# Altium project Capstone_SDR_PLUTOV2.PrjPcb (part 2 of 2)

## Sheet POWERMANAGE2.SchDoc
size A3; SheetNumber: 11; SheetTotal: 13; SPICEModelCacheVRZJBZTH: <root> / <DocumentId>VRZJBZTH</DocumentId> / <CacheFrame Number="0"> / <Model Name="emk105bj105_v-f" Kind="CKT"> / <Text>* EMK105BJ105_V-F     SPICE MODEL  ( General Type ) / *-------------------------------------------------------------------------------------------------------- / * Model Generated by TAIYO YUDEN Corporation (http://www.ty-top.com) / * Version 1.0 / * TAIYO YUDEN Control No. 170508_130520 / * Copyright(c) 2012 TAIYO YUDEN CO.,LTD. All Rights Reserved. / *-------------------------------------------------------------------------------------------------------- / * / * Products Name : Multilayer Ceramic Capacitors / * / * Characteristics : / *     Capacitance : 1 uF , Rated Voltage : 16V , TCC : X5R / *     Case Size : 1.0 x 0.5 / 0.039 x 0.02 [mm/inch] , Thickness : 0.5 / 0.02 [mm/inch] / *     (Conditions: Temperature = 25 degC , DC Bias Current/Voltage = 0A / 0V) / * / * Frequency Range : 40Hz - 3GHz / * / * External Node Assignments : / * / *  1  o---| |---o  2 / * / *-------------------------------------------------------------------------------------------------------- / .SubCkt EMK105BJ105_V-F 1 2 / **************************** / C0 1 110 0.68309u / Cm 1 101 0.26053u / C1 101 102 0.94076u / Rc1 101 102 1.9029k / C2 102 103 0.66707u / Rc2 102 103 120.36 / C3 103 110 0.57203u / Rc3 103 110 2.1097 / C2m 1 301 0.1871u / C21 301 302 3.2494u / Rc21 301 302 1.1117k / C22 302 303 2.1014u / Rc22 302 303 1.484k / C23 303 304 2.1172u / Rc23 303 304 1.3876k / C24 304 305 0.75729u / Rc24 304 305 332.59 / C25 305 306 0.94401u / Rc25 305 306 249.09 / C26 306 307 0.34674u / Rc26 306 307 28.352 / C27 307 308 0.37158u / Rc27 307 308 19.989 / C28 308 309 0.17933u / Rc28 308 309 31.748 / C29 309 110 0.016445u / Rc29 309 110 1.0592 / Rp0 1 110 100Meg / L0 110 120 0.2216n / Lm 120 130 0.1509n / L1 120 121 0.12659n / RL1 121 130 0.85161 / L2 120 122 0.15996n / RL2 122 130 0.42469 / L3 120 123 7.9543n / RL3 123 130 0.54643m / CR 120 124 0.24334u / LR 124 125 0.090738n / RR 125 130 68.076m / CL 130 140 2.7354p / LL 130 140 0.10762n / RL 130 140 50.614 / Rs 140 2 7.5416m / **************************** / .ends EMK105BJ105_V-F</Text> / </Model> / </CacheFrame> / </root>
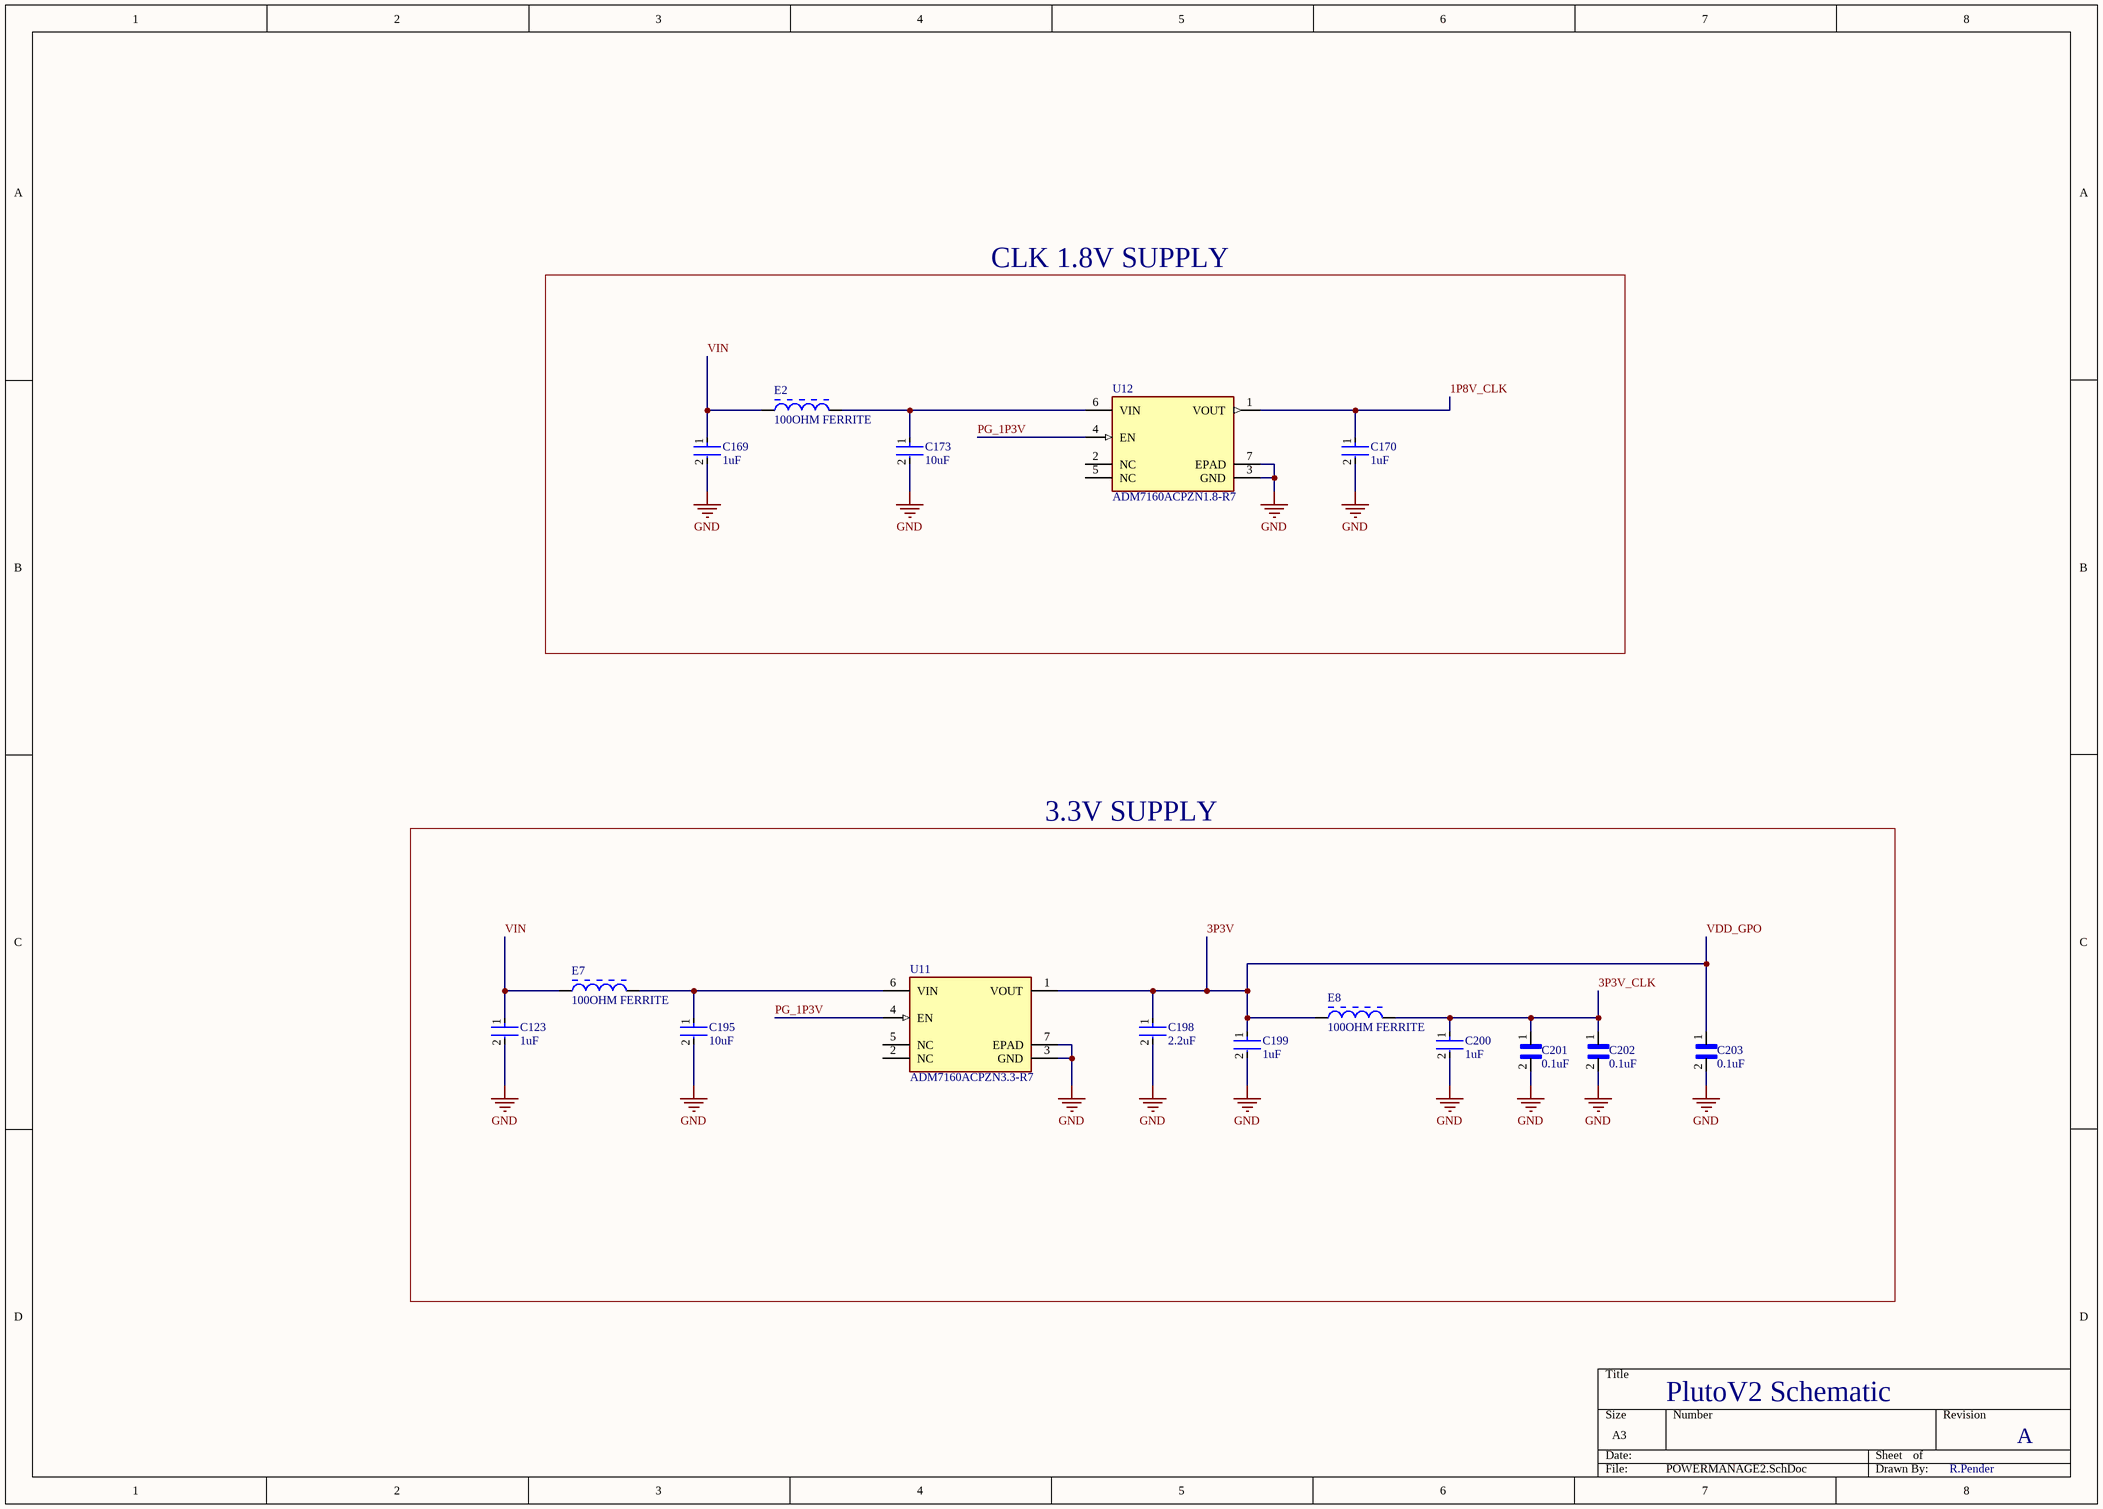
[diagram p4: POWERMANAGE2.SchDoc]

### Parts
C123  1uF  [FP-0402-L_1_0_0_05-W_0_5-IPC_A]
C169  1uF  [FP-0402-L_1_0_0_05-W_0_5-IPC_A]
C170  1uF  [FP-0402-L_1_0_0_05-W_0_5-IPC_B]
C173  10uF  [FP-GRM188-0_15-MFG]
C195  10uF  [FP-GRM188-0_15-MFG]
C198  2.2uF  [FP-GRM188-0_2-MFG]
C199  1uF  [FP-0402-L_1_0_0_05-W_0_5-IPC_A]
C200  1uF  [FP-0402-L_1_0_0_05-W_0_5-IPC_A]
C201  0.1uF  [CAPC0603X33N]
C202  0.1uF  [CAPC0603X33N]
C203  0.1uF  [CAPC0603X33N]
E2  100OHM FERRITE  [TDK-MPZ2012S101A-2_V]
E7  100OHM FERRITE  [TDK-MPZ2012S101A-2_V]
E8  100OHM FERRITE  [TDK-MPZ2012S101A-2_V]
U11  ADM7160ACPZN3.3-R7  [FP-CP-6-3-IPC_A]
U12  ADM7160ACPZN1.8-R7  [FP-CP-6-3-IPC_C]

### Blocks framed on the sheet
CLK 1.8V SUPPLY: C169 C170 C173 E2 U12
3.3V SUPPLY: C123 C195 C198-C203 E7 E8 U11

### Nets
GND: C123.2 C169.2 C170.2 C173.2 C195.2 C198.2 C199.2 C200.2 C201.2 C202.2 C203.2 U11.3(GND) U11.7(EPAD) U12.3(GND) U12.7(EPAD)
1P8V_CLK: C170.1 U12.1(VOUT)
3P3V: C198.1 C199.1 C203.1 E8.1 U11.1(VOUT)  [also labelled VDD_GPO]
3P3V_CLK: C200.1 C201.1 C202.1 E8.2
PG_1P3V: U11.4(EN) U12.4(EN)
VIN: C123.1 C169.1 E2.1 E7.1
NetC173_1: C173.1 E2.2 U12.6(VIN)
NetC195_1: C195.1 E7.2 U11.6(VIN)

Not connected (* = marked no-connect by the designer): U11 2(NC) 5(NC); U12 2(NC) 5(NC)

### Notes on the sheet
- PlutoV2 Schematic
- A
- R.Pender

### Library data of the parts
C123 C169 C170 C199 C200 = CMP-14477-000104-2: None; Tolerance: 10%; Voltage Rating: 16V; Dielectric: X5R; Packaging: Tape and Reel; Depth: 0.5mm; Mount: Surface Mount; Thickness: 0.022inch; Package Quantity: 1; Min Operating Temperature: -55°C; Series: M; Voltage Rating (DC): 16V; Termination: SMD/SMT; Case/Package: 0402; Number of Pins: 2; Case Code (Imperial): 0402; Capacitance: 1uF; Length: 1mm; Halogen Free: Halogen Free; Case Code (Metric): 1005; Width: 0.02inch; RoHS Compliant: Yes; Radiation Hardening: No; Max Operating Temperature: 85°C; Height: 0.5mm; Construction: Flat
C173 C195 = CMP-06035-003612-1: Chip Multilayer Ceramic Capacitors for General Purpose, 0603, 10uF, X5R, 15%, 20%, 10V; Tolerance: 20%; Dielectric: X5R; Package Quantity: 4000; Width: 0.8mm; Case/Package: 0603; Thickness: 0.035inch; Capacitance: 10uF; Voltage Rating: 10V; Voltage Rating (DC): 10V; Termination: SMD/SMT; Length: 1.6mm; Lead Free: Lead Free; Mount: Surface Mount; Height: 0.8mm; Depth: 0.8mm; Packaging: Tape and Reel; Weight: 0.000222oz; Min Operating Temperature: -55°C; Case Code (Metric): 1608; Max Operating Temperature: 85°C; Case Code (Imperial): 0603; Material: Ceramic
C198 = CMP-06035-023692-1: Chip Multilayer Ceramic Capacitors for General Purpose, 0603, 2.2uF, X5R, 15%, 10%, 50V; Mount: Surface Mount; Case/Package: 0603; Voltage Rating (DC): 50V; Weight: 0.000222oz; Capacitance: 2.2uF; Max Operating Temperature: 85°C; Length: 0.063inch; Thickness: 0.039inch; Dielectric: X5R; Min Operating Temperature: -55°C; Termination: SMD/SMT; Resistor Type: Ceramic; Width: 0.8mm; Voltage Rating: 50V; Height: 0.8mm; Tolerance: 10%; Case Code (Metric): 1608; Package Quantity: 10000; Packaging: Tape and Reel; Case Code (Imperial): 0603
C201-C203 = GRM033R61C104ME84D: CAP 0.1UF 16VDC X5R 20% SMD 0201 PAPER TAPE; Package: None; Price: None; Value: *; MP: GRM033R61C104ME84D; Availability: Unavailable
E2 E7 E8 = CMP-2000-05399-1: Chip Bead for Power Line, 100 Ohm, +/- 25%, 4 A, -55 to 125 degC, 0805 (2012 Metric), RoHS, Tape and Reel; Manufacturer: TDK; Maximum DC Resistance: 20mOhms; Test Frequency: 100MHz; Impedance: 100Ohms; Case Width: 1.25mm; Case Length: 2mm; Maximum DC Current: 4A; Case Height: 0.85mm; Package Reference: MPZ2012S101A-2; RoHS: Details; Tolerance: 25%; Operating Temperature Range: -55Cto+125C; Datasheet Version: Jul-13; Dimensions: 1.25mmWx2mmLx0.85mmH; Product: FerriteChipBeads; Termination Style: SMD/SMT; Datasheet URL: http://www.farnell.com/datasheets/1750041.pdf; Factory Pack Quantity: 4000; Brand: TDK; Packaging: Reel; Package Description: 2-Pin Surface Mount Device, Body 2 x 1.25 mm; Product Category: EMIFilterBeads,Chips&Arrays; Manufacturer URL: http://www.tdk.com/; Package / Case: 0805(2012metric)
U11 = CMP-09138-000129-1: IC REG LINEAR 3.3V 200MA 6LFCSP; Output Type: Fixed; Max Supply Current: 265uA; Max Input Voltage: 5.5V; Number of Regulators: 1; Power Supply Rejection Ratio (PSRR): 49dB; Operating Supply Current: 265mA; Polarity: Positive; Min Input Voltage: 2.2V; Dropout Voltage: 150mV; Accuracy: 1%; Min Current Limit: 220mA; Max Output Current: 200mA; RoHS Compliant: Yes; Case/Package: TSOT; Max Operating Temperature: 125°C; Contact Plating: Gold; Number of Pins: 6; Mount: Surface Mount; Packaging: Tape and Reel; Number of Outputs: 1; Lead Free: Contains Lead; Package Quantity: 3000; Min Operating Temperature: -40°C; Output Voltage: 3.3V; Output Current: 200mA; Quiescent Current: 265uA
U12 = CMP-09138-000112-1: IC REG LINEAR 1.8V 200MA 6LFCSP; Operating Supply Current: 265mA; Power Supply Rejection Ratio (PSRR): 49dB; Polarity: Positive; Max Supply Current: 265uA; Dropout Voltage: 230mV; Number of Outputs: 1; Min Current Limit: 220mA; Output Type: Fixed; Accuracy: 1%; Min Input Voltage: 2.2V; Max Input Voltage: 5.5V; Packaging: Tape and Reel; Case/Package: TSOT; Contact Plating: Gold; Mount: Surface Mount; Max Output Current: 200mA; Min Operating Temperature: -40°C; Output Voltage: 1.8V; Output Current: 200mA; Number of Pins: 6; Package Quantity: 3000; Lead Free: Contains Lead; Quiescent Current: 265uA; Max Operating Temperature: 125°C; Number of Regulators: 1; RoHS Compliant: Yes

## Sheet TESTPOINTS.SchDoc
size A3; SheetNumber: 12; SheetTotal: 14
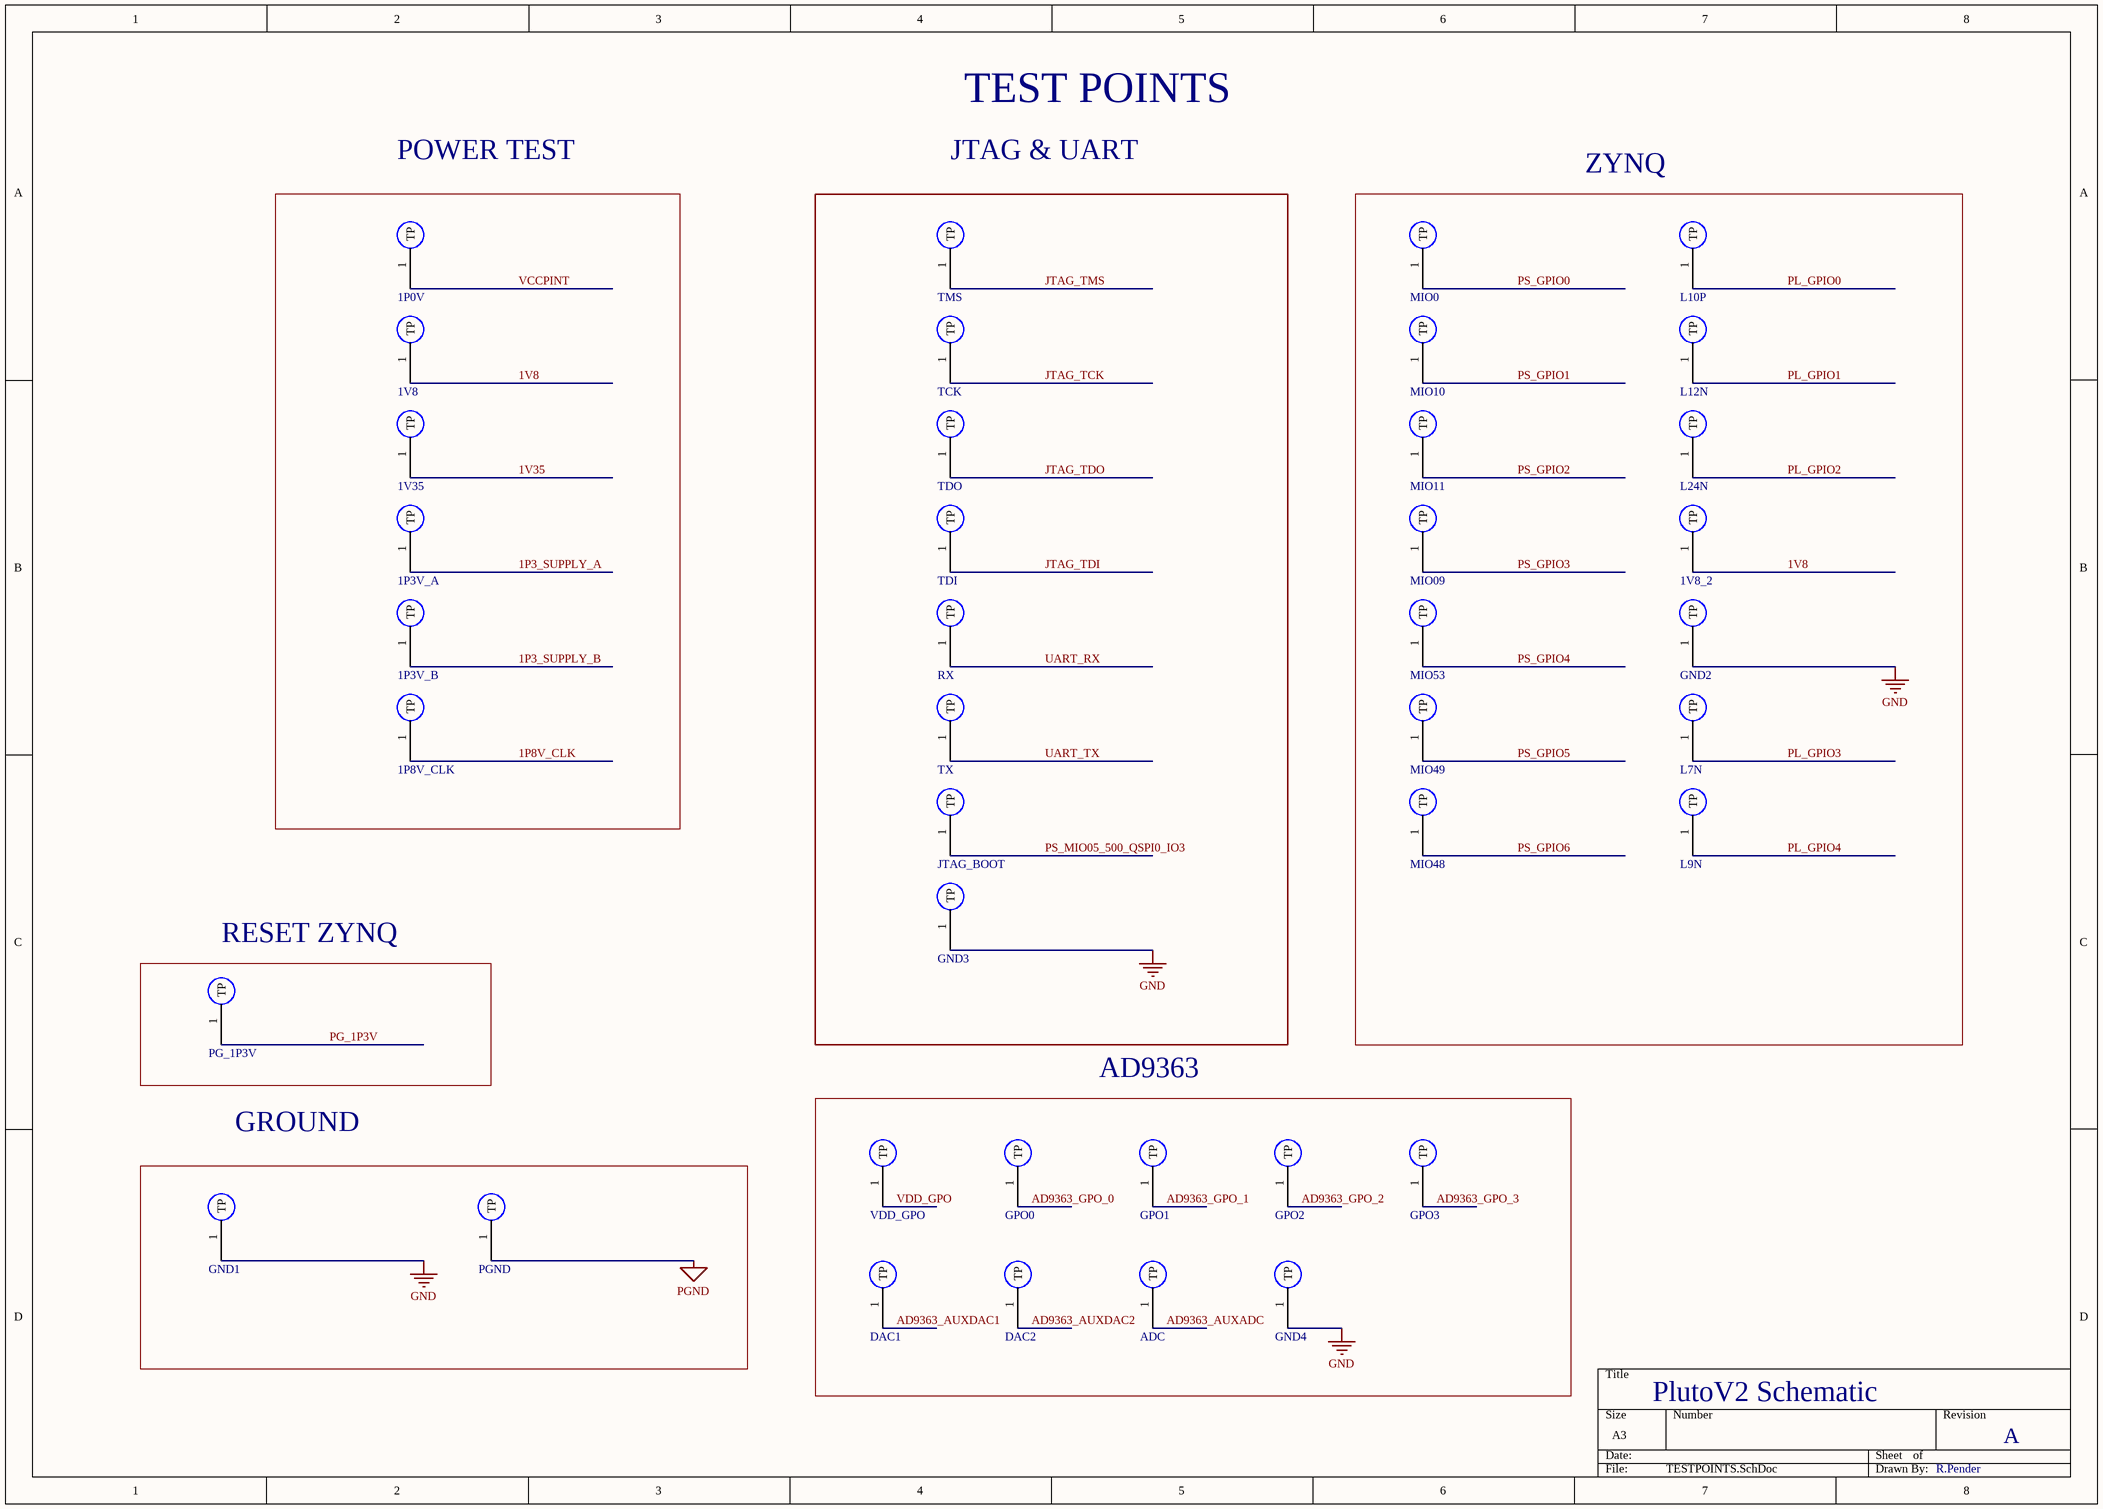
[diagram p5: TESTPOINTS.SchDoc]

### Parts
1P0V  TEST POINT  [TESTPOINT1]  (value not drawn)  (no BOM)
1P3V_A  TEST POINT  [TESTPOINT1]  (value not drawn)  (no BOM)
1P3V_B  TEST POINT  [TESTPOINT1]  (value not drawn)  (no BOM)
1P8V_CLK  TEST POINT  [TESTPOINT1]  (value not drawn)  (no BOM)
1V8  TEST POINT  [TESTPOINT1]  (value not drawn)  (no BOM)
1V8_2  TEST POINT  [TESTPOINT1]  (value not drawn)  (no BOM)
1V35  TEST POINT  [TESTPOINT1]  (value not drawn)  (no BOM)
ADC  TEST POINT  [TESTPOINT1]  (value not drawn)  (no BOM)
DAC1  TEST POINT  [TESTPOINT1]  (value not drawn)  (no BOM)
DAC2  TEST POINT  [TESTPOINT1]  (value not drawn)  (no BOM)
GND1  TEST POINT  [TESTPOINT1]  (value not drawn)  (no BOM)
GND2  TEST POINT  [TESTPOINT1]  (value not drawn)  (no BOM)
GND3  TEST POINT  [TESTPOINT1]  (value not drawn)  (no BOM)
GND4  TEST POINT  [TESTPOINT1]  (value not drawn)  (no BOM)
GPO0  TEST POINT  [TESTPOINT1]  (value not drawn)  (no BOM)
GPO1  TEST POINT  [TESTPOINT1]  (value not drawn)  (no BOM)
GPO2  TEST POINT  [TESTPOINT1]  (value not drawn)  (no BOM)
GPO3  TEST POINT  [TESTPOINT1]  (value not drawn)  (no BOM)
JTAG_BOOT  TEST POINT  [TESTPOINT1]  (value not drawn)  (no BOM)
L7N  TEST POINT  [TESTPOINT1]  (value not drawn)  (no BOM)
L9N  TEST POINT  [TESTPOINT1]  (value not drawn)  (no BOM)
L10P  TEST POINT  [TESTPOINT1]  (value not drawn)  (no BOM)
L12N  TEST POINT  [TESTPOINT1]  (value not drawn)  (no BOM)
L24N  TEST POINT  [TESTPOINT1]  (value not drawn)  (no BOM)
MIO0  TEST POINT  [TESTPOINT1]  (value not drawn)  (no BOM)
MIO09  TEST POINT  [TESTPOINT1]  (value not drawn)  (no BOM)
MIO10  TEST POINT  [TESTPOINT1]  (value not drawn)  (no BOM)
MIO11  TEST POINT  [TESTPOINT1]  (value not drawn)  (no BOM)
MIO48  TEST POINT  [TESTPOINT1]  (value not drawn)  (no BOM)
MIO49  TEST POINT  [TESTPOINT1]  (value not drawn)  (no BOM)
MIO53  TEST POINT  [TESTPOINT1]  (value not drawn)  (no BOM)
PG_1P3V  TEST POINT  [TESTPOINT1]  (value not drawn)  (no BOM)
PGND  TEST POINT  [TESTPOINT1]  (value not drawn)  (no BOM)
RX  TEST POINT  [TESTPOINT1]  (value not drawn)  (no BOM)
TCK  TEST POINT  [TESTPOINT1]  (value not drawn)  (no BOM)
TDI  TEST POINT  [TESTPOINT1]  (value not drawn)  (no BOM)
TDO  TEST POINT  [TESTPOINT1]  (value not drawn)  (no BOM)
TMS  TEST POINT  [TESTPOINT1]  (value not drawn)  (no BOM)
TX  TEST POINT  [TESTPOINT1]  (value not drawn)  (no BOM)
VDD_GPO  TEST POINT  [TESTPOINT1]  (value not drawn)  (no BOM)

### Blocks framed on the sheet
ZYNQ: 1V8_2 GND2 L7N L9N L10P L12N L24N MIO0 MIO09-MIO11 MIO48 MIO49 MIO53
RESET ZYNQ: PG_1P3V
AD9363: ADC DAC1 DAC2 GND4 GPO0-GPO3 VDD_GPO

### Nets
GND: GND1.1(TP) GND2.1(TP) GND3.1(TP) GND4.1(TP)
PGND: PGND.1(TP)
1P3_SUPPLY_A: 1P3V_A.1(TP)
1P3_SUPPLY_B: 1P3V_B.1(TP)
1P8V_CLK: 1P8V_CLK.1(TP)
1v8: 1V8.1(TP) 1V8_2.1(TP)
1v35: 1V35.1(TP)
AD9363_AUXADC: ADC.1(TP)
AD9363_AUXDAC1: DAC1.1(TP)
AD9363_AUXDAC2: DAC2.1(TP)
AD9363_GPO_0: GPO0.1(TP)
AD9363_GPO_1: GPO1.1(TP)
AD9363_GPO_2: GPO2.1(TP)
AD9363_GPO_3: GPO3.1(TP)
JTAG_TCK: TCK.1(TP)
JTAG_TDI: TDI.1(TP)
JTAG_TDO: TDO.1(TP)
JTAG_TMS: TMS.1(TP)
PG_1P3V: PG_1P3V.1(TP)
PL_GPIO0: L10P.1(TP)
PL_GPIO1: L12N.1(TP)
PL_GPIO2: L24N.1(TP)
PL_GPIO3: L7N.1(TP)
PL_GPIO4: L9N.1(TP)
PS_GPIO0: MIO0.1(TP)
PS_GPIO1: MIO10.1(TP)
PS_GPIO2: MIO11.1(TP)
PS_GPIO3: MIO09.1(TP)
PS_GPIO4: MIO53.1(TP)
PS_GPIO5: MIO49.1(TP)
PS_GPIO6: MIO48.1(TP)
PS_MIO05_500_QSPI0_IO3: JTAG_BOOT.1(TP)
UART_RX: RX.1(TP)
UART_TX: TX.1(TP)
VCCPINT: 1P0V.1(TP)
VDD_GPO: VDD_GPO.1(TP)  [project net 3P3V]

### Notes on the sheet
- TEST POINTS
- POWER TEST
- JTAG & UART
- GROUND
- PlutoV2 Schematic
- A
- R.Pender

### Library data of the parts
1P0V 1P3V_A 1P3V_B 1P8V_CLK 1V8 1V8_2 1V35 ADC DAC1 DAC2 GND1-GND4 GPO0-GPO3 JTAG_BOOT L7N L9N L10P L12N L24N MIO0 MIO09-MIO11 MIO48 MIO49 MIO53 PG_1P3V PGND RX TCK TDI TDO TMS TX VDD_GPO = TESTPT

## Sheet RF Frontend 2.SchDoc
size A3; SheetNumber: 14; SheetTotal: 14
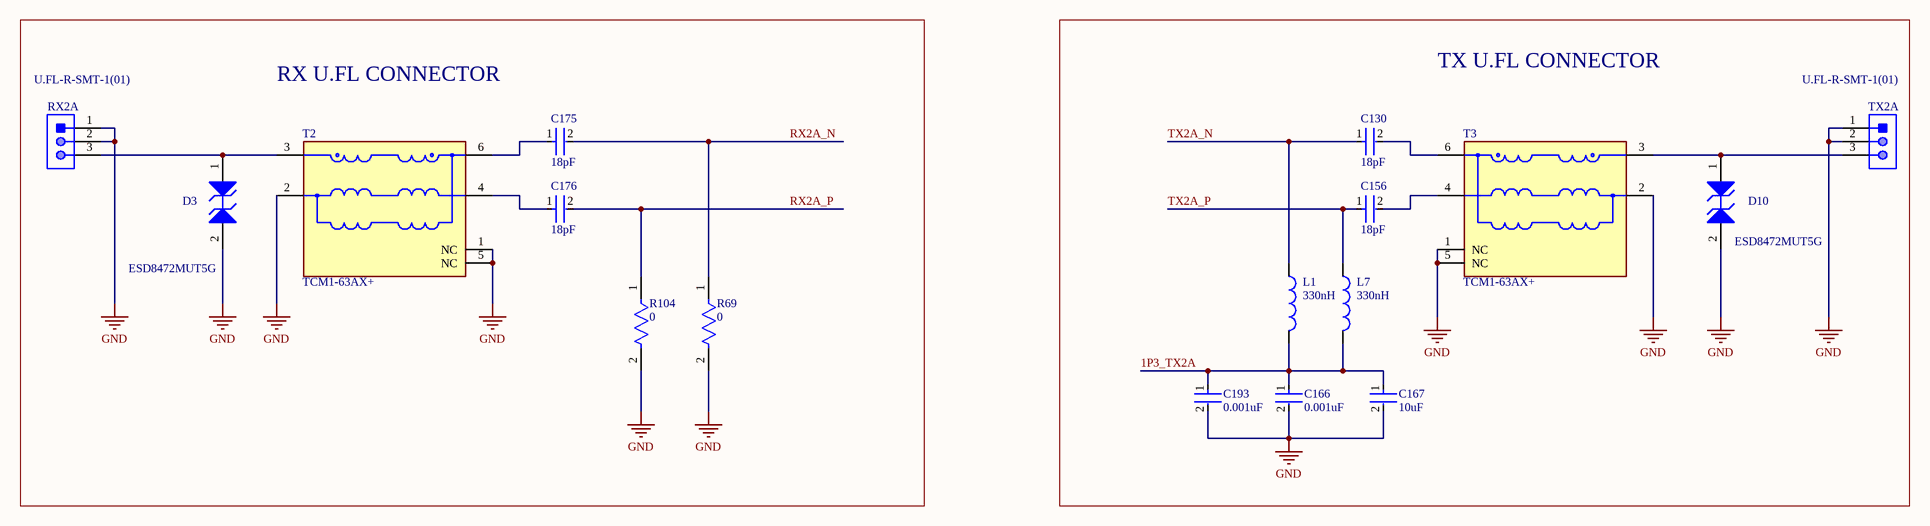
[diagram p6: RF Frontend 2.SchDoc]

### Parts
C130  18pF  [FP-GRM033-0_03-IPC_A]
C156  18pF  [FP-GRM033-0_03-IPC_A]
C166  0.001uF  [FP-GRM033-0_03-MFG]
C167  10uF  [FP-GRM188-0_1-e0_2_0_55-IPC_C]
C175  18pF  [FP-GRM033-0_03-IPC_A]
C176  18pF  [FP-GRM033-0_03-IPC_A]
C193  0.001uF  [FP-GRM033-0_03-MFG]
D3  ESD8472MUT5G  [ONSC-X3DFN-2-152AF-01_V]
D10  ESD8472MUT5G  [ONSC-X3DFN-2-152AF-01_V]
L1  330nH  [INDC2317X140N]
L7  330nH  [INDC2317X140N]
R69  0  [FP-ERJ1GN-MFG]
R104  0  [FP-ERJ1GN-MFG]
RX2A  U.FL-R-SMT-1(01)  [HRS-U.FL-R-SMT-3_V]
T2  TCM1-63AX+  [FP-TCM1-63AX+-MFG]
T3  TCM1-63AX+  [FP-TCM1-63AX+-MFG]
TX2A  U.FL-R-SMT-1(01)  [HRS-U.FL-R-SMT-3_V]

### Blocks framed on the sheet
RX U.FL CONNECTOR: C175 C176 D3 R69 R104 RX2A T2
TX U.FL CONNECTOR: C130 C156 C166 C167 C193 D10 L1 L7 T3 TX2A

### Nets
GND: C166.2 C167.2 C193.2 D3.2(A2) D10.2(A2) R69.2 R104.2 RX2A.1 RX2A.2 T2.1(NC) T2.2(GND) T2.5(NC) T3.1(NC) T3.2(GND) T3.5(NC) TX2A.1 TX2A.2
1P3_TX2A: C166.1 C167.1 C193.1 L1.2 L7.2  [project net 1P3_SUPPLY_B]
RX2A_N: C175.2 R69.1
RX2A_P: C176.2 R104.1
TX2A_N: C130.1 L1.1
TX2A_P: C156.1 L7.1
NetC130_2: C130.2 T3.6(SECONDARY_DOT)
NetC156_2: C156.2 T3.4(SECONDARY)
NetC175_1: C175.1 T2.6(SECONDARY_DOT)
NetC176_1: C176.1 T2.4(SECONDARY)
NetD3_1: D3.1(A1) RX2A.3 T2.3(PRIMARY_DOT)
NetD10_1: D10.1(A1) T3.3(PRIMARY_DOT) TX2A.3

### Library data of the parts
C130 C156 C175 C176 = CMP-2010-01507-2: Chip Multilayer Ceramic Capacitors for General Purpose, 0201, 18pF, C0G, 30ppm/°C, 5%, 50V; Max Operating Temperature: 125°C; Case Code (Metric): 0603; Case Code (Imperial): 0201; Capacitance: 18pF; Voltage Rating (DC): 50V; Lead Free: Lead Free; Mount: Surface Mount; Radiation Hardening: No; Height: 0.3mm; Package Quantity: 15000; Depth: 0.3mm; Tolerance: 5%; Thickness: 0.013inch; Width: 0.3mm; Packaging: Tape and Reel; Voltage Rating: 50V; Dielectric: C0G; Length: 0.6mm; Termination: SMD/SMT; Min Operating Temperature: -55°C; Case/Package: 0201; Voltage: 50V
C166 C193 = CMP-2010-01706-2: Chip Multilayer Ceramic Capacitors for General Purpose, 0201, 1000pF, X7R, 15%, 10%, 25V; Capacitance: 1nF; Max Operating Temperature: 125°C; Material: Ceramic; Lead Free: Lead Free; Radiation Hardening: No; Dielectric: X7R; Height: 0.3mm; Mount: Surface Mount; Packaging: Tape and Reel; Termination: SMD/SMT; Thickness: 0.013inch; Case Code (Metric): 0603; Tolerance: 10%; Voltage Rating (DC): 25V; REACH SVHC: No SVHC; Package Quantity: 1; Depth: 0.3mm; Voltage: 25V; Case/Package: 0201; Case Code (Imperial): 0201; Voltage Rating: 25V; Min Operating Temperature: -55°C; Length: 0.6mm; Width: 0.012inch
C167 = CMP-2006-02792-2: Chip Multilayer Ceramic Capacitors for General Purpose, 0603, 10uF, X5R, 15%, 20%, 6.3V; Packaging: Tape and Reel; Voltage Rating (DC): 6.3V; Width: 0.031inch; Termination: SMD/SMT; Dielectric: X5R; Package Quantity: 4000; Voltage Rating: 6.3V; Capacitance: 10uF; Case/Package: 0603; Min Operating Temperature: -55°C; Voltage: 6.3V; Length: 1.6mm; Thickness: 0.035inch; Lead Free: Lead Free; Depth: 0.8mm; Case Code (Imperial): 0603; Max Operating Temperature: 85°C; Material: Ceramic; Height: 0.8mm; Tolerance: 20%; Mount: Surface Mount; REACH SVHC: No SVHC; Radiation Hardening: No; Case Code (Metric): 1608
D3 D10 = CMP-1063-00281-1: Ultra-Low Capacitance ESD Protection, Micro-Packaged Diode for ESD Protection, 2-Pin X3DFN, Pb-Free, Tape and Reel; Manufacturer: On Semiconductor; IR Max (uA): 0.05; C Max (pF): 0.3; V(BR) Min (V): 7; VRWM Max (V): 5.3; Number of Lines: 1; Direction: Bidirectional; PartNumber: ESD8472MUT5G; PackageVersion: Rev. O, 04/2011; RoHS: Pb-Free; PackageDescription: 2-Pin Small Outline No-Lead, Body 0.62 x 0.32 mm, Pitch 0.355 mm; ComponentLink1Description: Manufacturer URL; ComponentLink1URL: http://www.onsemi.com/; Packing: Tape and Reel; Mounting Technology: Surface Mount; PackageReference: X3DFN-2-152AF-01; ComponentLink3Description: Package Specification; ComponentLink2Description: Datasheet; ComponentLink3URL: http://www.onsemi.cn/pub_link/Collateral/152AF.PDF; DatasheetVersion: Rev. 4; ComponentLink2URL: http://www.onsemi.cn/pub_link/Collateral/ESD8472-D.PDF
L1 L7 = Inductor: Code_IEC: 1005; Value: 10mH; Published: 8-Jun-2000; LatestRevisionDate: 29-May-2009; LatestRevisionNote: IPC-7351 Footprint Added.; PackageReference: 0402-A; Publisher: Altium Limited; PackageDescription: Chip Inductor; Code_JEITA: 0402
R69 R104 = CMP-1010-00001-3: RES SMD 0 OHM JUMPER 1/20W 0201; Temperature Coefficient: 600ppm/°C; Max Power Dissipation: 50mW; Resistance: 0R; Voltage Rating: 25V; Tolerance: 1%; Package Quantity: 15000; Case Code (Imperial): 0201; Number of Terminations: 2; Depth: 0.3mm; Lead Free: Lead Free; Military Standard: Not; Width: 0.3mm; Series: ERJ; Max Operating Temperature: 125°C; Construction: Rectangular; Contact Plating: Tin; RoHS Compliant: Yes; Height: 0.23mm; Voltage Rating (DC): 25V; Mount: Surface Mount; Min Operating Temperature: -55°C; Power Rating: 50mW; Features: Automotive AEC-Q200; Resistor Type: Thick Film; Case/Package: 0201; Case Code (Metric): 0603; Length: 0.6mm; Packaging: Tape and Reel
RX2A TX2A = CMP-2000-05153-1: Ultra Small Coaxial Connector, 6 GHz, -40 to 90 degC, 3-Pin SMD, RoHS, Bulk; Manufacturer: Hirose Electric; Connector Style: U.FL; Impedance: 50Ohm; Dielectric Material: LiquidCrystalPolymer(LCP); Minimum Quantity: UltraMiniatureCoaxial; Online Catalog: U.FLSeries; Featured Product: HiroseU.FLSeries; Frequency - Max: 6GHz; Other Names: H122041 / U.FL-R-SMT-1(01)-ND; Contact Termination: Solder; Body Material: PhosphorBronze; Connector Type: Jack,MalePin; Body Finish: Silver; Center Contact Plating: Gold; Manufacturer URL: https://www.hirose.com; Family: CoaxialConnectors(RF); Fastening Type: Snap-On; Unit PriceUSD: U.FL; Series: U.FL; Package Reference: U.FL-R-SMT; Packaging: Bulk; Standard Package: 100; Mounting Type: SurfaceMount; Quantity Available: Bulk; Housing Color: Silver; Package Description: 3-Pin Surface Mount Device, Body 2.6 x 2.6 mm; Category: Connectors,Interconnects; Operating Temperature: -40degC~90degC; Center Contact Material: PhosphorBronze; Dynamic Catalog: U.FLSeries; Datasheet URL: https://datasheet.ciiva.com/26945/getdatasheetpartid-475239-26945414.pdf; Datasheet Version: Feb-09; Shield Termination: Solder
T2 T3 = CMP-199822-000001-1: 1:1 CORE & WIRE Transformer, 10 - 6000 MHz, 50Ω; Manufacturer: Mini-Circuits; Insertion Loss: 1.16-1.8dB; Return Loss: 9.42-16.9dB; Lead Free: Yes; Device Class L3: unset; Temperature: -40°C to +85°C; Manufacturer Part Number: TCM1-63AX+; Frequency: 10-6000MHz; Device Class L2: Transformers; RoHS: TRUE; Octopart: https://octopart.com/tcm1-63ax%2B-mini-circuits-107315723; Temperature Range Low: -40°C; Category: Trans; Package: 0; ComponentLink2URL: https://www.minicircuits.com/pdfs/TCM1-63AX+.pdf; ComponentLink2Description: Datasheet; Automotive: No; Height: 4.06mm; Device Class L1: Passive Components; Temperature Range High: +85°C; Turns Ratio: 1:1

## Nets that join several sheets
GND: ZYNQ JTAG and Decoupling (70 pins), RF FRONTEND (31 pins), CONNECTORS_SELECTORS (22 pins), POWERMANAGE (57 pins), POWERMANAGE2 (15 pins), TESTPOINTS (GND1.1 GND2.1 GND3.1 GND4.1), RF Frontend 2 (17 pins)
PGND: CONNECTORS_SELECTORS (5 pins), TESTPOINTS (PGND.1)
1P3_SUPPLY_A: POWERMANAGE (18 pins), TESTPOINTS (1P3V_A.1)
1P3_SUPPLY_B: RF FRONTEND (5 pins), POWERMANAGE (20 pins), TESTPOINTS (1P3V_B.1), RF Frontend 2 (5 pins)
1P8V_CLK: POWERMANAGE2 (C170.1 U12.1), TESTPOINTS (1P8V_CLK.1)
1v8: ZYNQ JTAG and Decoupling (36 pins), CONNECTORS_SELECTORS (P1.10), POWERMANAGE (15 pins), TESTPOINTS (1V8.1 1V8_2.1)
1v35: ZYNQ JTAG and Decoupling (14 pins), TESTPOINTS (1V35.1)
3P3V: POWERMANAGE2 (5 pins), TESTPOINTS (VDD_GPO.1)
JTAG_TCK: ZYNQ JTAG and Decoupling (U4.G9), CONNECTORS_SELECTORS (P1.4), TESTPOINTS (TCK.1)
JTAG_TDI: ZYNQ JTAG and Decoupling (U4.L7), CONNECTORS_SELECTORS (P1.8), TESTPOINTS (TDI.1)
JTAG_TDO: ZYNQ JTAG and Decoupling (U4.L8), CONNECTORS_SELECTORS (P1.6), TESTPOINTS (TDO.1)
JTAG_TMS: ZYNQ JTAG and Decoupling (U4.L9), CONNECTORS_SELECTORS (P1.2), TESTPOINTS (TMS.1)
PG_1P3V: POWERMANAGE (U1.5 U7.5), POWERMANAGE2 (U11.4 U12.4), TESTPOINTS (PG_1P3V.1)
PS_MIO05_500_QSPI0_IO3: CONNECTORS_SELECTORS (P1.5), TESTPOINTS (JTAG_BOOT.1)
UART_RX: CONNECTORS_SELECTORS (P1.1), TESTPOINTS (RX.1)
UART_TX: CONNECTORS_SELECTORS (P1.3), TESTPOINTS (TX.1)
VCCPINT: ZYNQ JTAG and Decoupling (17 pins), POWERMANAGE (6 pins), TESTPOINTS (1P0V.1)
VIN: ZYNQ JTAG and Decoupling (DS1.1 DS2.1), CONNECTORS_SELECTORS (C184.1 C185.1 U8.9-10 U8.15-16), POWERMANAGE (C8.1 C9.1 C11.1 R1.2), POWERMANAGE2 (C123.1 C169.1 E2.1 E7.1)